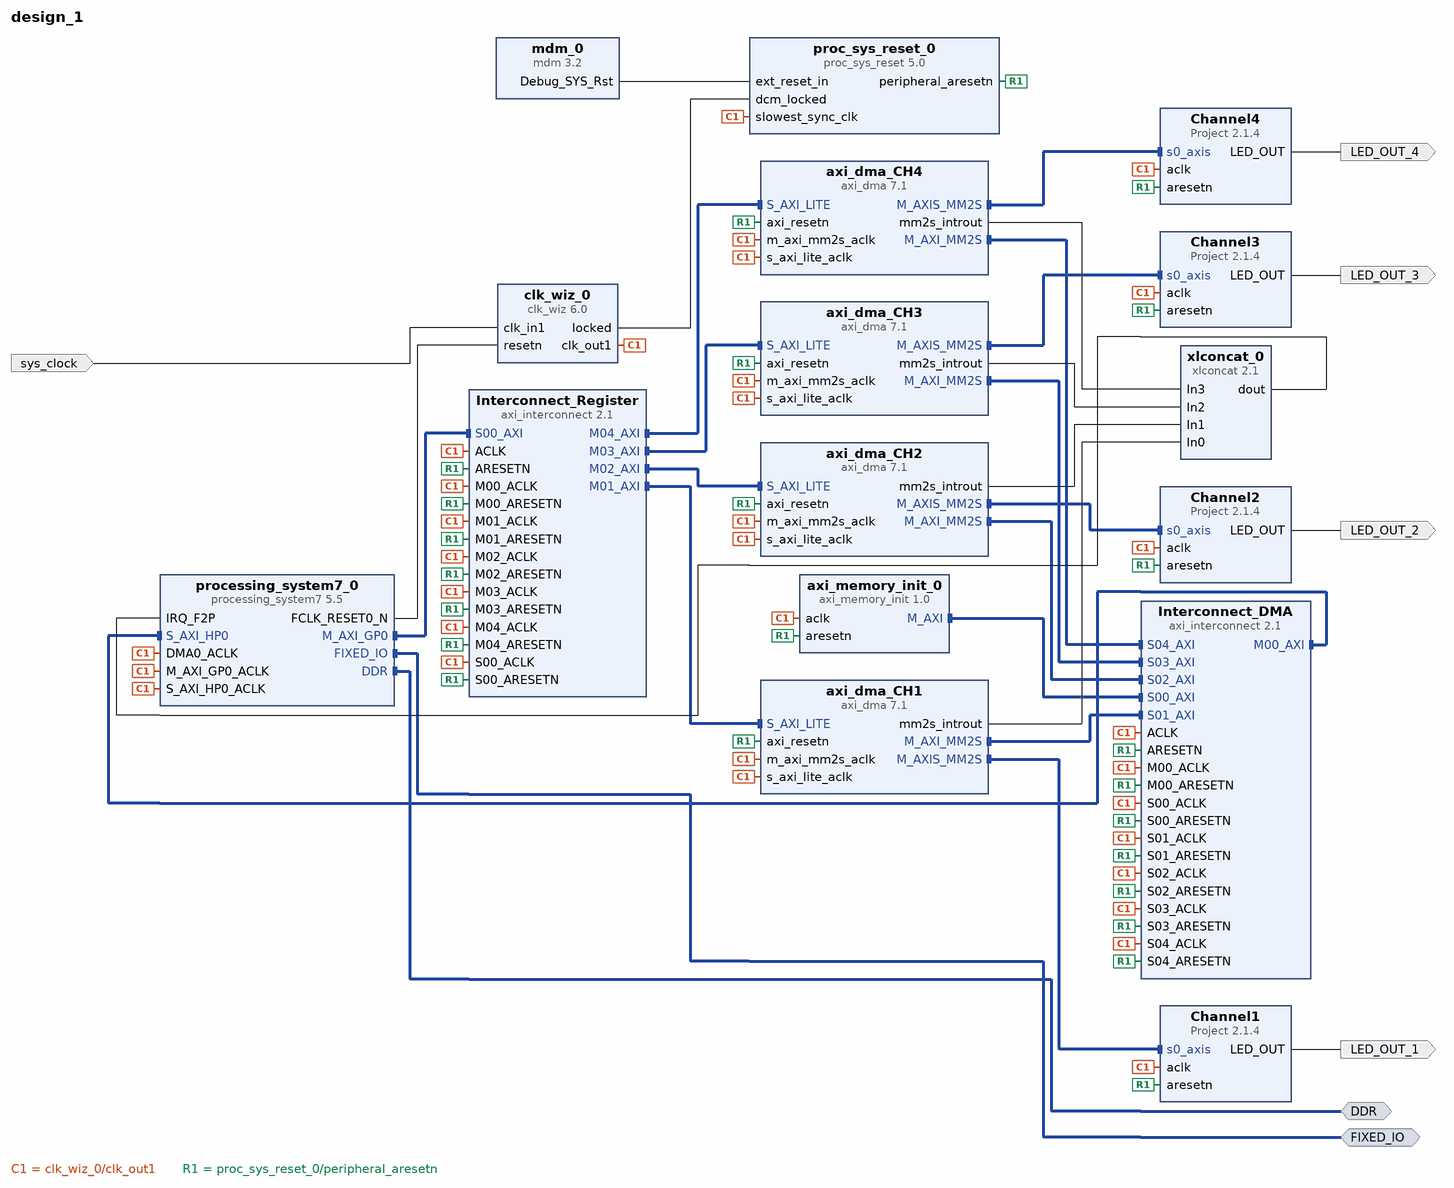
[diagram p0: block diagram of the top level]
# Vivado block design design_1, xc7z010clg400-1, Vivado 2020.2
create_bd_design design_1

create_bd_intf_port -mode Master -vlnv xilinx.com:interface:ddrx_rtl:1.0 DDR
create_bd_intf_port -mode Master -vlnv xilinx.com:display_processing_system7:fixedio_rtl:1.0 FIXED_IO
create_bd_port -dir O LED_OUT_1
create_bd_port -dir O LED_OUT_2
create_bd_port -dir O LED_OUT_3
create_bd_port -dir O LED_OUT_4
create_bd_port -dir I -type clk sys_clock
set_property -dict {CONFIG.FREQ_HZ 125000000 CONFIG.PHASE 0.000} [get_bd_ports sys_clock]

create_bd_cell -type ip -vlnv xilinx.com:ip:axi_memory_init:1.0 axi_memory_init_0
create_bd_cell -type ip -vlnv xilinx.com:ip:mdm:3.2 mdm_0
create_bd_cell -type ip -vlnv xilinx.com:ip:axi_interconnect:2.1 Interconnect_Register
set_property -dict {CONFIG.NUM_MI 5} [get_bd_cells Interconnect_Register]
create_bd_cell -type ip -vlnv xilinx.com:ip:axi_dma:7.1 axi_dma_CH1
set_property -dict [list \
  CONFIG.c_include_mm2s_dre 0 \
  CONFIG.c_include_s2mm 0 \
  CONFIG.c_include_sg 0 \
  CONFIG.c_micro_dma 0 \
  CONFIG.c_sg_length_width 24 \
] [get_bd_cells axi_dma_CH1]
create_bd_cell -type ip -vlnv xilinx.com:ip:axi_interconnect:2.1 Interconnect_DMA
set_property -dict {CONFIG.ENABLE_ADVANCED_OPTIONS 0 CONFIG.NUM_MI 1 CONFIG.NUM_SI 5} [get_bd_cells Interconnect_DMA]
create_bd_cell -type ip -vlnv xilinx.com:ip:axi_dma:7.1 axi_dma_CH2
set_property -dict [list \
  CONFIG.c_include_mm2s_dre 0 \
  CONFIG.c_include_s2mm 0 \
  CONFIG.c_include_sg 0 \
  CONFIG.c_micro_dma 0 \
  CONFIG.c_sg_length_width 24 \
] [get_bd_cells axi_dma_CH2]
create_bd_cell -type ip -vlnv xilinx.com:ip:axi_dma:7.1 axi_dma_CH3
set_property -dict {CONFIG.c_include_s2mm 0 CONFIG.c_include_sg 0} [get_bd_cells axi_dma_CH3]
create_bd_cell -type ip -vlnv xilinx.com:ip:axi_dma:7.1 axi_dma_CH4
set_property -dict [list \
  CONFIG.c_include_mm2s_dre 0 \
  CONFIG.c_include_s2mm 0 \
  CONFIG.c_include_sg 0 \
  CONFIG.c_micro_dma 0 \
  CONFIG.c_sg_length_width 24 \
] [get_bd_cells axi_dma_CH4]
create_bd_cell -type ip -vlnv xilinx.com:ip:xlconcat:2.1 xlconcat_0
set_property -dict {CONFIG.NUM_PORTS 4} [get_bd_cells xlconcat_0]
create_bd_cell -type ip -vlnv xilinx.com:ip:clk_wiz:6.0 clk_wiz_0
set_property -dict [list \
  CONFIG.CLKIN1_JITTER_PS 80.0 \
  CONFIG.CLKOUT1_JITTER 124.615 \
  CONFIG.CLKOUT1_PHASE_ERROR 96.948 \
  CONFIG.CLK_IN1_BOARD_INTERFACE sys_clock \
  CONFIG.MMCM_CLKFBOUT_MULT_F 8.000 \
  CONFIG.MMCM_CLKIN1_PERIOD 8.000 \
  CONFIG.RESET_PORT resetn \
  CONFIG.RESET_TYPE ACTIVE_LOW \
  CONFIG.USE_BOARD_FLOW true \
] [get_bd_cells clk_wiz_0]
create_bd_cell -type ip -vlnv xilinx.com:ip:proc_sys_reset:5.0 proc_sys_reset_0
create_bd_cell -type ip -vlnv xilinx.com:ip:processing_system7:5.5 processing_system7_0
set_property -dict [list \
  CONFIG.PCW_APU_PERIPHERAL_FREQMHZ 650 \
  CONFIG.PCW_CRYSTAL_PERIPHERAL_FREQMHZ 50 \
  CONFIG.PCW_ENET0_PERIPHERAL_ENABLE 0 \
  CONFIG.PCW_FPGA0_PERIPHERAL_FREQMHZ 50 \
  CONFIG.PCW_FPGA1_PERIPHERAL_FREQMHZ 50 \
  CONFIG.PCW_GPIO_MIO_GPIO_ENABLE 1 \
  CONFIG.PCW_GPIO_MIO_GPIO_IO MIO \
  CONFIG.PCW_I2C_RESET_ENABLE 1 \
  CONFIG.PCW_IRQ_F2P_INTR 1 \
  CONFIG.PCW_P2F_DMAC0_INTR 1 \
  CONFIG.PCW_PERIPHERAL_BOARD_PRESET part0 \
  CONFIG.PCW_PRESET_BANK1_VOLTAGE {LVCMOS 1.8V} \
  CONFIG.PCW_QSPI_PERIPHERAL_ENABLE 0 \
  CONFIG.PCW_SD0_PERIPHERAL_ENABLE 0 \
  CONFIG.PCW_S_AXI_HP0_DATA_WIDTH 32 \
  CONFIG.PCW_UART0_PERIPHERAL_ENABLE 1 \
  CONFIG.PCW_UART0_UART0_IO {MIO 14 .. 15} \
  CONFIG.PCW_UART1_PERIPHERAL_ENABLE 0 \
  CONFIG.PCW_UART_PERIPHERAL_FREQMHZ 100 \
  CONFIG.PCW_UIPARAM_DDR_BUS_WIDTH {16 Bit} \
  CONFIG.PCW_UIPARAM_DDR_FREQ_MHZ 525 \
  CONFIG.PCW_UIPARAM_DDR_PARTNO {MT41K256M16 RE-125} \
  CONFIG.PCW_USB0_PERIPHERAL_ENABLE 1 \
  CONFIG.PCW_USB0_RESET_ENABLE 1 \
  CONFIG.PCW_USB0_RESET_IO {MIO 46} \
  CONFIG.PCW_USB0_USB0_IO {MIO 28 .. 39} \
  CONFIG.PCW_USB_RESET_ENABLE 1 \
  CONFIG.PCW_USB_RESET_SELECT {Share reset pin} \
  CONFIG.PCW_USE_DMA0 1 \
  CONFIG.PCW_USE_FABRIC_INTERRUPT 1 \
  CONFIG.PCW_USE_S_AXI_HP0 1 \
] [get_bd_cells processing_system7_0]
# 504 more settings of processing_system7_0 are not shown: defaults, MIO pin electricals, DDR timing, and values the tool derives
create_bd_cell -type ip -vlnv OTH:user:Project:2.1.4 Channel4
create_bd_cell -type ip -vlnv OTH:user:Project:2.1.4 Channel1
create_bd_cell -type ip -vlnv OTH:user:Project:2.1.4 Channel2
create_bd_cell -type ip -vlnv OTH:user:Project:2.1.4 Channel3

# ---- connections ----

connect_bd_intf_net [get_bd_intf_pins axi_dma_CH1/M_AXI_MM2S] [get_bd_intf_pins Interconnect_DMA/S01_AXI]
connect_bd_intf_net [get_bd_intf_pins Interconnect_Register/M02_AXI] [get_bd_intf_pins axi_dma_CH2/S_AXI_LITE]
connect_bd_intf_net [get_bd_intf_pins Interconnect_Register/M01_AXI] [get_bd_intf_pins axi_dma_CH1/S_AXI_LITE]
connect_bd_intf_net [get_bd_intf_pins axi_memory_init_0/M_AXI] [get_bd_intf_pins Interconnect_DMA/S00_AXI]
connect_bd_intf_net [get_bd_intf_pins axi_dma_CH3/M_AXIS_MM2S] [get_bd_intf_pins Channel3/s0_axis]
connect_bd_intf_net [get_bd_intf_pins axi_dma_CH3/M_AXI_MM2S] [get_bd_intf_pins Interconnect_DMA/S03_AXI]
connect_bd_intf_net [get_bd_intf_pins axi_dma_CH4/M_AXI_MM2S] [get_bd_intf_pins Interconnect_DMA/S04_AXI]
connect_bd_intf_net [get_bd_intf_pins Interconnect_Register/M03_AXI] [get_bd_intf_pins axi_dma_CH3/S_AXI_LITE]
connect_bd_intf_net [get_bd_intf_pins axi_dma_CH4/S_AXI_LITE] [get_bd_intf_pins Interconnect_Register/M04_AXI]
connect_bd_intf_net [get_bd_intf_pins axi_dma_CH1/M_AXIS_MM2S] [get_bd_intf_pins Channel1/s0_axis]
connect_bd_intf_net [get_bd_intf_pins axi_dma_CH4/M_AXIS_MM2S] [get_bd_intf_pins Channel4/s0_axis]
connect_bd_intf_net -intf_net axi_interconnect_0_M00_AXI [get_bd_intf_pins Interconnect_DMA/M00_AXI] [get_bd_intf_pins processing_system7_0/S_AXI_HP0]
connect_bd_intf_net -intf_net axi_dma_1_M_AXI_MM2S [get_bd_intf_pins axi_dma_CH2/M_AXI_MM2S] [get_bd_intf_pins Interconnect_DMA/S02_AXI]
connect_bd_intf_net [get_bd_intf_ports FIXED_IO] [get_bd_intf_pins processing_system7_0/FIXED_IO]
connect_bd_intf_net [get_bd_intf_pins processing_system7_0/M_AXI_GP0] [get_bd_intf_pins Interconnect_Register/S00_AXI]
connect_bd_intf_net [get_bd_intf_ports DDR] [get_bd_intf_pins processing_system7_0/DDR]
connect_bd_intf_net -intf_net axi_dma_1_M_AXIS_MM2S [get_bd_intf_pins axi_dma_CH2/M_AXIS_MM2S] [get_bd_intf_pins Channel2/s0_axis]
connect_bd_net [get_bd_pins clk_wiz_0/clk_out1] \
  [get_bd_pins Interconnect_Register/ACLK] [get_bd_pins Interconnect_Register/S00_ACLK] \
  [get_bd_pins Interconnect_Register/M00_ACLK] [get_bd_pins Interconnect_Register/M01_ACLK] \
  [get_bd_pins Interconnect_Register/M02_ACLK] [get_bd_pins axi_dma_CH1/s_axi_lite_aclk] \
  [get_bd_pins axi_dma_CH1/m_axi_mm2s_aclk] [get_bd_pins Interconnect_DMA/ACLK] [get_bd_pins Interconnect_DMA/S00_ACLK] \
  [get_bd_pins Interconnect_DMA/M00_ACLK] [get_bd_pins axi_memory_init_0/aclk] [get_bd_pins Interconnect_DMA/S01_ACLK] \
  [get_bd_pins axi_dma_CH2/m_axi_mm2s_aclk] [get_bd_pins axi_dma_CH2/s_axi_lite_aclk] \
  [get_bd_pins axi_dma_CH3/s_axi_lite_aclk] [get_bd_pins axi_dma_CH3/m_axi_mm2s_aclk] \
  [get_bd_pins axi_dma_CH4/s_axi_lite_aclk] [get_bd_pins axi_dma_CH4/m_axi_mm2s_aclk] [get_bd_pins Interconnect_DMA/S02_ACLK] \
  [get_bd_pins Interconnect_DMA/S03_ACLK] [get_bd_pins Interconnect_DMA/S04_ACLK] \
  [get_bd_pins Interconnect_Register/M03_ACLK] [get_bd_pins Interconnect_Register/M04_ACLK] \
  [get_bd_pins proc_sys_reset_0/slowest_sync_clk] [get_bd_pins processing_system7_0/M_AXI_GP0_ACLK] \
  [get_bd_pins processing_system7_0/S_AXI_HP0_ACLK] [get_bd_pins processing_system7_0/DMA0_ACLK] [get_bd_pins Channel4/aclk] \
  [get_bd_pins Channel1/aclk] [get_bd_pins Channel2/aclk] [get_bd_pins Channel3/aclk]
connect_bd_net [get_bd_pins proc_sys_reset_0/peripheral_aresetn] \
  [get_bd_pins Interconnect_Register/S00_ARESETN] [get_bd_pins Interconnect_Register/M00_ARESETN] \
  [get_bd_pins Interconnect_Register/ARESETN] [get_bd_pins Interconnect_Register/M01_ARESETN] \
  [get_bd_pins Interconnect_Register/M02_ARESETN] [get_bd_pins axi_dma_CH1/axi_resetn] \
  [get_bd_pins axi_memory_init_0/aresetn] [get_bd_pins Interconnect_DMA/ARESETN] [get_bd_pins Interconnect_DMA/S00_ARESETN] \
  [get_bd_pins Interconnect_DMA/M00_ARESETN] [get_bd_pins Interconnect_DMA/S01_ARESETN] [get_bd_pins axi_dma_CH2/axi_resetn] \
  [get_bd_pins axi_dma_CH3/axi_resetn] [get_bd_pins axi_dma_CH4/axi_resetn] [get_bd_pins Interconnect_DMA/S02_ARESETN] \
  [get_bd_pins Interconnect_DMA/S03_ARESETN] [get_bd_pins Interconnect_DMA/S04_ARESETN] \
  [get_bd_pins Interconnect_Register/M03_ARESETN] [get_bd_pins Interconnect_Register/M04_ARESETN] \
  [get_bd_pins Channel4/aresetn] [get_bd_pins Channel1/aresetn] [get_bd_pins Channel2/aresetn] [get_bd_pins Channel3/aresetn]
connect_bd_net [get_bd_pins mdm_0/Debug_SYS_Rst] [get_bd_pins proc_sys_reset_0/ext_reset_in]
connect_bd_net -net Project_0_LED_OUT [get_bd_pins Channel1/LED_OUT] [get_bd_ports LED_OUT_1]
connect_bd_net -net Project_1_LED_OUT [get_bd_pins Channel2/LED_OUT] [get_bd_ports LED_OUT_2]
connect_bd_net -net Project_CH3_LED_OUT [get_bd_pins Channel3/LED_OUT] [get_bd_ports LED_OUT_3]
connect_bd_net [get_bd_pins Channel4/LED_OUT] [get_bd_ports LED_OUT_4]
connect_bd_net [get_bd_pins clk_wiz_0/locked] [get_bd_pins proc_sys_reset_0/dcm_locked]
connect_bd_net [get_bd_ports sys_clock] [get_bd_pins clk_wiz_0/clk_in1]
connect_bd_net [get_bd_pins processing_system7_0/FCLK_RESET0_N] [get_bd_pins clk_wiz_0/resetn]
connect_bd_net [get_bd_pins axi_dma_CH1/mm2s_introut] [get_bd_pins xlconcat_0/In0]
connect_bd_net [get_bd_pins axi_dma_CH2/mm2s_introut] [get_bd_pins xlconcat_0/In1]
connect_bd_net [get_bd_pins axi_dma_CH3/mm2s_introut] [get_bd_pins xlconcat_0/In2]
connect_bd_net [get_bd_pins axi_dma_CH4/mm2s_introut] [get_bd_pins xlconcat_0/In3]
connect_bd_net [get_bd_pins xlconcat_0/dout] [get_bd_pins processing_system7_0/IRQ_F2P]

# ---- address map ----
assign_bd_address -offset 0x00000000 -range 512M -target_address_space [get_bd_addr_spaces axi_dma_CH1/Data_MM2S] [get_bd_addr_segs processing_system7_0/S_AXI_HP0/HP0_DDR_LOWOCM]
assign_bd_address -offset 0x00000000 -range 512M -target_address_space [get_bd_addr_spaces axi_dma_CH2/Data_MM2S] [get_bd_addr_segs processing_system7_0/S_AXI_HP0/HP0_DDR_LOWOCM]
assign_bd_address -offset 0x00000000 -range 512M -target_address_space [get_bd_addr_spaces axi_dma_CH3/Data_MM2S] [get_bd_addr_segs processing_system7_0/S_AXI_HP0/HP0_DDR_LOWOCM]
assign_bd_address -offset 0x00000000 -range 512M -target_address_space [get_bd_addr_spaces axi_dma_CH4/Data_MM2S] [get_bd_addr_segs processing_system7_0/S_AXI_HP0/HP0_DDR_LOWOCM]
assign_bd_address -offset 0x40400000 -range 64K -target_address_space [get_bd_addr_spaces processing_system7_0/Data] [get_bd_addr_segs axi_dma_CH1/S_AXI_LITE/Reg]
assign_bd_address -offset 0x40410000 -range 64K -target_address_space [get_bd_addr_spaces processing_system7_0/Data] [get_bd_addr_segs axi_dma_CH2/S_AXI_LITE/Reg]
assign_bd_address -offset 0x40420000 -range 64K -target_address_space [get_bd_addr_spaces processing_system7_0/Data] [get_bd_addr_segs axi_dma_CH3/S_AXI_LITE/Reg]
assign_bd_address -offset 0x40430000 -range 64K -target_address_space [get_bd_addr_spaces processing_system7_0/Data] [get_bd_addr_segs axi_dma_CH4/S_AXI_LITE/Reg]

validate_bd_design
save_bd_design
